# Altium schematic sheet RFDIO.SchDoc: RFDIO
size A4 portrait; Author: Carlos Barreiro; Revision: 1.0; SheetNumber: 5; SheetTotal: 5; Organization: Escuela Técnica Superior de Ingeniería de Sistemas Informáticos de la Universidad Politécnica de Madrid; Address1: Campus Sur de la Universidad Politécnica de Madrid; Address2: Calle de Alan Turing, s/nº; Address3: Madrid 28031; Address4: España
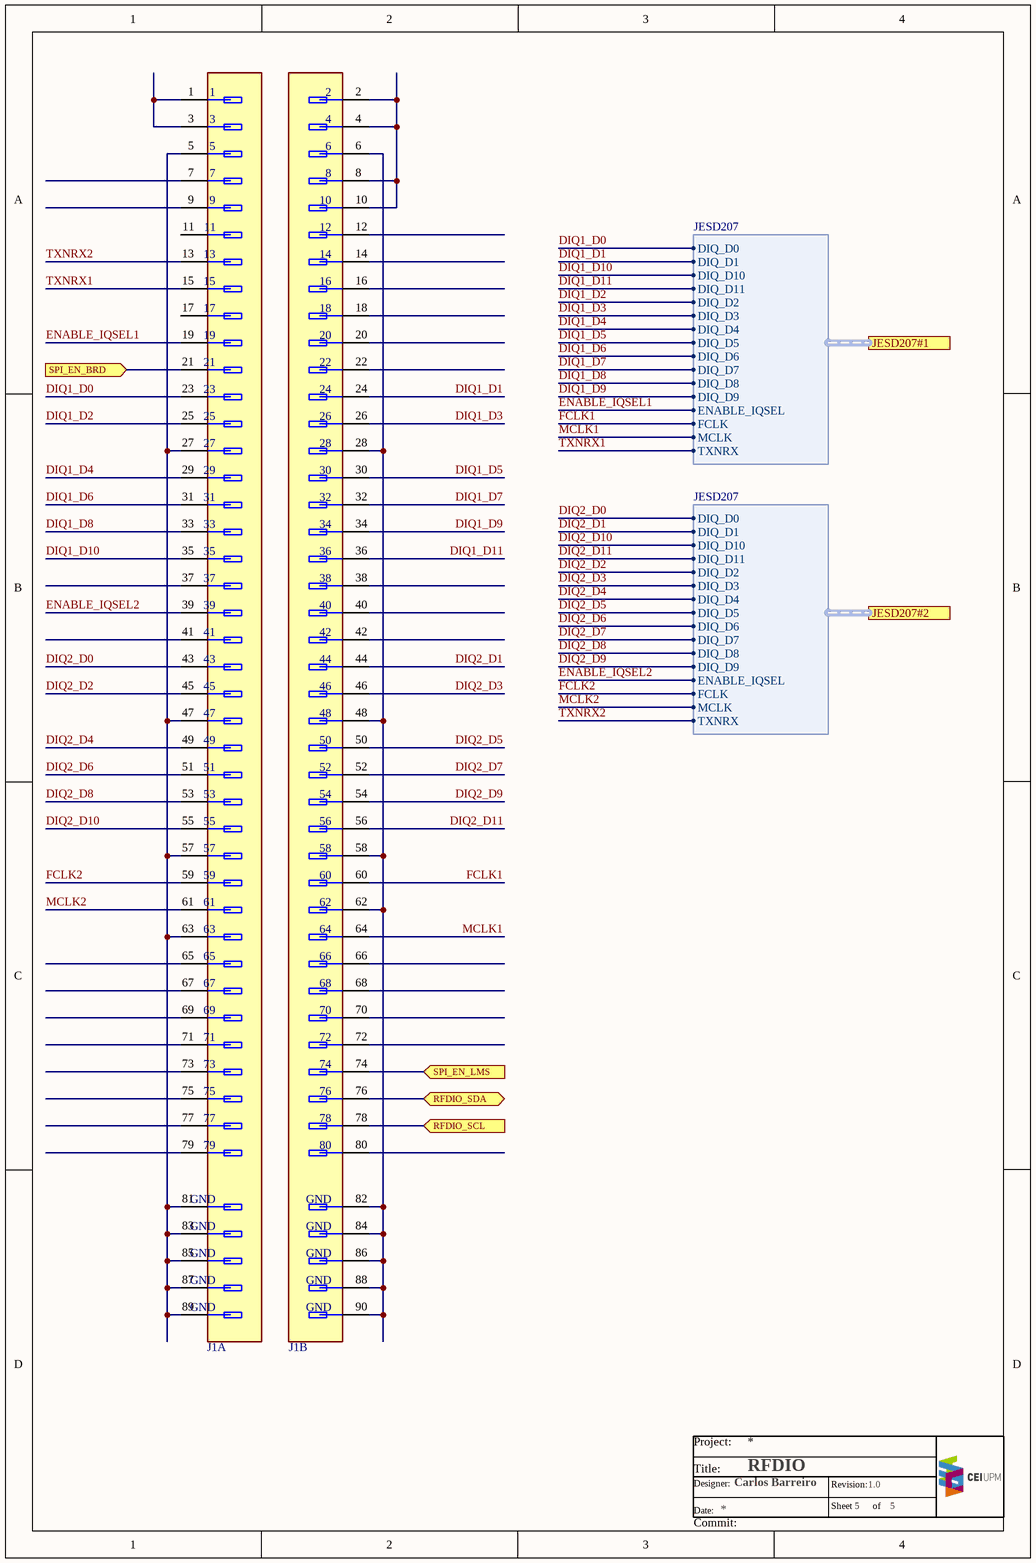
[diagram p0: RFDIO.SchDoc]

## Parts
J1  FX10A-80S/8-SV  [HRS_FX10A-80S/8-SV]  (value not drawn)  (parts A,B of 2)

## Ports
JESD207#1 (harness JESD207), JESD207#2 (harness JESD207), RFDIO_SCL (in), RFDIO_SDA (bidir), SPI_EN_BRD (in), SPI_EN_LMS (in)

## Harnesses
JESD207: DIQ_D0, DIQ_D1, DIQ_D10, DIQ_D11, DIQ_D2, DIQ_D3, DIQ_D4, DIQ_D5, DIQ_D6, DIQ_D7, DIQ_D8, DIQ_D9, ENABLE_IQSEL, FCLK, MCLK, TXNRX

## Nets
DIQ1_D0: J1.23 ; port JESD207#1.DIQ_D0
DIQ1_D1: J1.24 ; port JESD207#1.DIQ_D1
DIQ1_D2: J1.25 ; port JESD207#1.DIQ_D2
DIQ1_D3: J1.26 ; port JESD207#1.DIQ_D3
DIQ1_D4: J1.29 ; port JESD207#1.DIQ_D4
DIQ1_D5: J1.30 ; port JESD207#1.DIQ_D5
DIQ1_D6: J1.31 ; port JESD207#1.DIQ_D6
DIQ1_D7: J1.32 ; port JESD207#1.DIQ_D7
DIQ1_D8: J1.33 ; port JESD207#1.DIQ_D8
DIQ1_D9: J1.34 ; port JESD207#1.DIQ_D9
DIQ1_D10: J1.35 ; port JESD207#1.DIQ_D10
DIQ1_D11: J1.36 ; port JESD207#1.DIQ_D11
DIQ2_D0: J1.43 ; port JESD207#2.DIQ_D0
DIQ2_D1: J1.44 ; port JESD207#2.DIQ_D1
DIQ2_D2: J1.45 ; port JESD207#2.DIQ_D2
DIQ2_D3: J1.46 ; port JESD207#2.DIQ_D3
DIQ2_D4: J1.49 ; port JESD207#2.DIQ_D4
DIQ2_D5: J1.50 ; port JESD207#2.DIQ_D5
DIQ2_D6: J1.51 ; port JESD207#2.DIQ_D6
DIQ2_D7: J1.52 ; port JESD207#2.DIQ_D7
DIQ2_D8: J1.53 ; port JESD207#2.DIQ_D8
DIQ2_D9: J1.54 ; port JESD207#2.DIQ_D9
DIQ2_D10: J1.55 ; port JESD207#2.DIQ_D10
DIQ2_D11: J1.56 ; port JESD207#2.DIQ_D11
ENABLE_IQSEL1: J1.19 ; port JESD207#1.ENABLE_IQSEL
ENABLE_IQSEL2: J1.39 ; port JESD207#2.ENABLE_IQSEL
FCLK1: J1.60 ; port JESD207#1.FCLK
FCLK2: J1.59 ; port JESD207#2.FCLK
MCLK1: J1.64 ; port JESD207#1.MCLK
MCLK2: J1.61 ; port JESD207#2.MCLK
RFDIO_SCL: J1.78 ; port RFDIO_SCL
RFDIO_SDA: J1.76 ; port RFDIO_SDA
SPI_EN_BRD: J1.21 ; port SPI_EN_BRD
SPI_EN_LMS: J1.74 ; port SPI_EN_LMS
TXNRX1: J1.15 ; port JESD207#1.TXNRX
TXNRX2: J1.13 ; port JESD207#2.TXNRX
NetJ1_1: J1.1 J1.3
NetJ1_2: J1.2 J1.4 J1.8 J1.10
NetJ1_5: J1.5 J1.27 J1.47 J1.57 J1.63 J1.81(GND) J1.83(GND) J1.85(GND) J1.87(GND) J1.89(GND)
NetJ1_6: J1.6 J1.28 J1.48 J1.58 J1.62 J1.82(GND) J1.84(GND) J1.86(GND) J1.88(GND) J1.90(GND)

Not connected (* = marked no-connect by the designer): J1 7 9 11 12 14 16 17 18 20 22 37 38 40 41 42 65 66 67 68 69 70 71 72 73 75 77 79 80

## Notes on the sheet
- Project:
- Title:
- Date:
- Designer:
- Sheet
- Revision:
- of
- Commit:

## Library data of the parts
J1 = FX10A-80S/8-SV: 80 Position Connector Header, Outer Shroud Contacts Surface Mount Gold; ComponentLink1Description: Manufacturer; ComponentLink1URL: https://www.hirose.com/en/product/p/CL0570-0121-7-71; Supplier 1: Digi-Key; Supplier 2: Mouser; Supplier Part Number 2: 798-FX10A80S8SV71; Supplier Part Number 1: H11232-ND